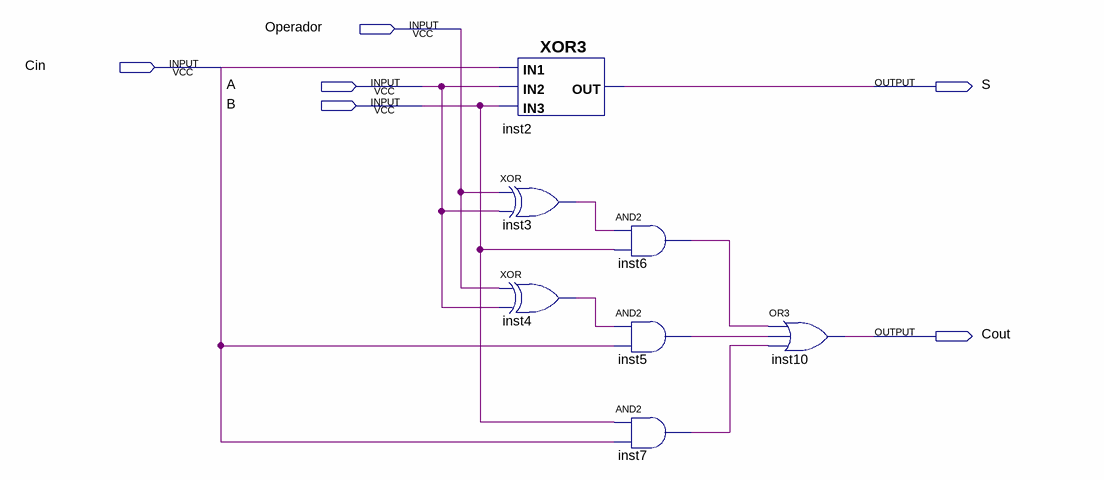
[diagram p0: schematic sheet]
// Quartus schematic somsub.bdf as structural Verilog: 7 symbols, 6 pins
module somsub (
  input  Operador,
  input  Cin,
  input  A,
  input  B,
  output S,
  output Cout
);

  wire inst3_out, inst4_out, inst5_out, inst6_out, inst7_out;

  XOR3 inst2 (.IN3(B), .IN1(Cin), .IN2(A), .OUT(S));
  xor inst3 (inst3_out, Operador, A);
  xor inst4 (inst4_out, Operador, A);
  and inst6 (inst6_out, inst3_out, B);
  and inst5 (inst5_out, inst4_out, Cin);
  and inst7 (inst7_out, B, Cin);
  or inst10 (Cout, inst6_out, inst5_out, inst7_out);
endmodule
